# Altium schematic sheet Power Monitor.SchDoc: Power Monitor
size OrCAD A; DocumentNumber: LM-003; Revision: 3.0; SheetNumber: 7; SheetTotal: 11
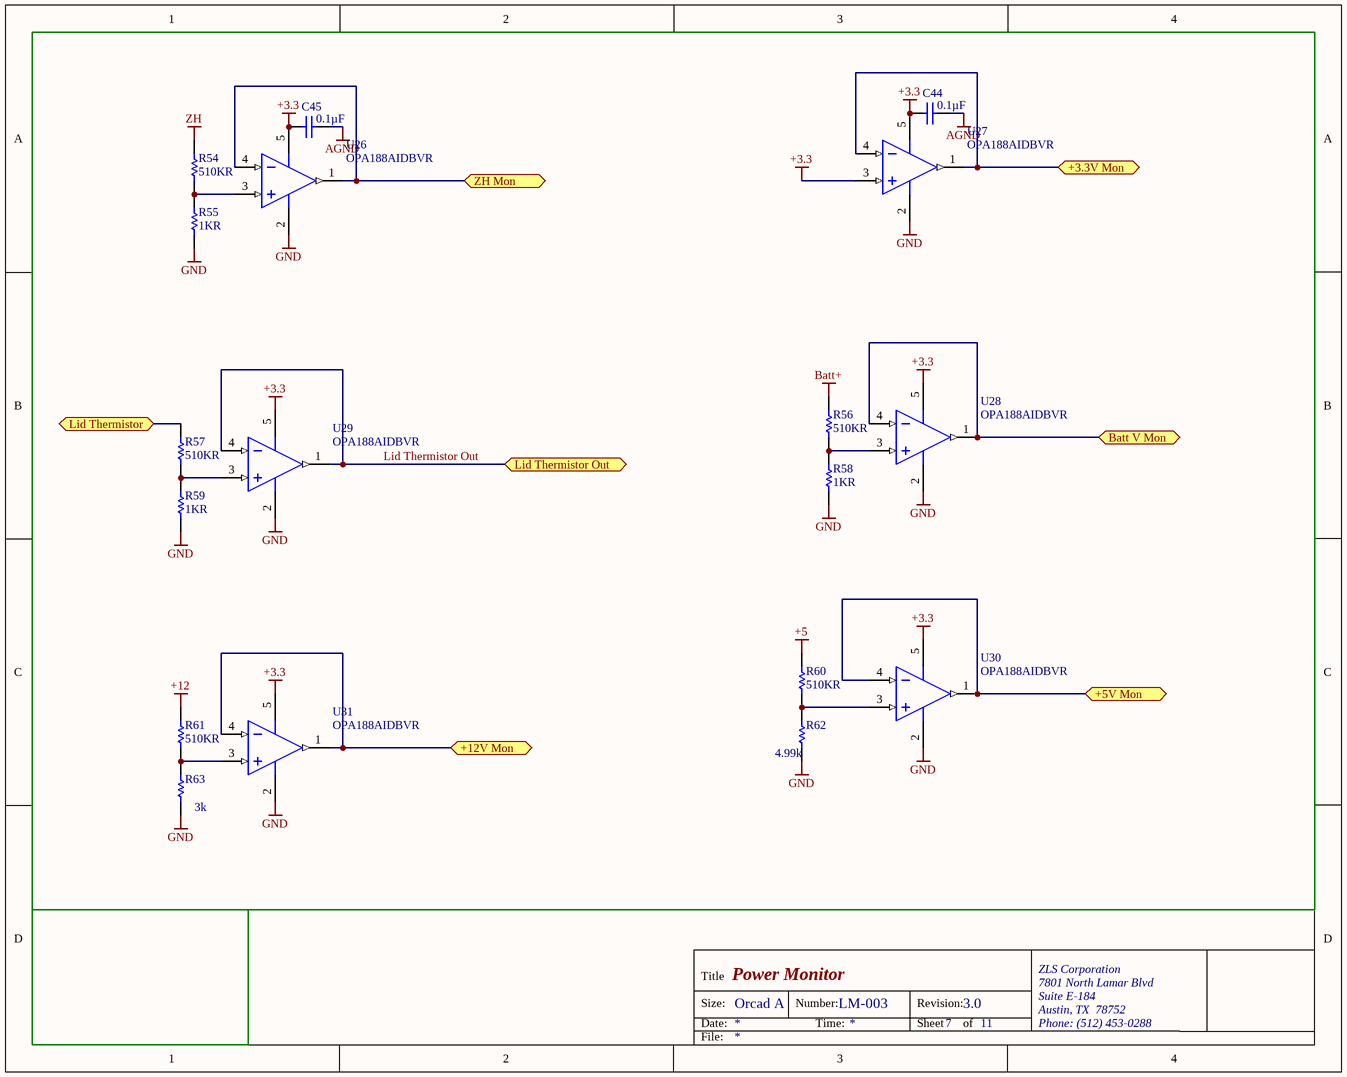
[diagram p0: Power Monitor.SchDoc]

## Parts
C44  Capacitance: 0.1µF  [CAPC0805(2012)145_N]  (hidden comment: CAP CER 0.1UF 25V X7R 0805)
C45  Capacitance: 0.1µF  [CAPC0805(2012)145_N]  (hidden comment: CAP CER 0.1UF 25V X7R 0805)
R54  Resistance: 510KR  [RESC0402(1005)_M]  (hidden comment: RES SMD 510K OHM 1% 1/16W 0402)
R55  Resistance: 1KR  [RESC0402(1005)_M]  (hidden comment: RES SMD 1K OHM 1% 1/16W 0402)
R56  Resistance: 510KR  [RESC0402(1005)_M]  (hidden comment: RES SMD 510K OHM 1% 1/16W 0402)
R57  Resistance: 510KR  [RESC0402(1005)_M]  (hidden comment: RES SMD 510K OHM 1% 1/16W 0402)
R58  Resistance: 1KR  [RESC0402(1005)_M]  (hidden comment: RES SMD 1K OHM 1% 1/16W 0402)
R59  Resistance: 1KR  [RESC0402(1005)_M]  (hidden comment: RES SMD 1K OHM 1% 1/16W 0402)
R60  Resistance: 510KR  [RESC0402(1005)_M]  (hidden comment: RES SMD 510K OHM 1% 1/16W 0402)
R61  Resistance: 510KR  [RESC0402(1005)_M]  (hidden comment: RES SMD 510K OHM 1% 1/16W 0402)
R62  Resistance (Ohms): 4.99k  [RESC0805(2012)_L]  (hidden comment: RES SMD 4.99K OHM 1% 1/8W 0805)
R63  Resistance (Ohms): 3k  [RESC0805(2012)_L]  (hidden comment: RES SMD 3K OHM 1% 1/2W 0805)
U26  OPA188AIDBVR  [DBV0005A_M]
U27  OPA188AIDBVR  [DBV0005A_M]
U28  OPA188AIDBVR  [DBV0005A_M]
U29  OPA188AIDBVR  [DBV0005A_M]
U30  OPA188AIDBVR  [DBV0005A_M]
U31  OPA188AIDBVR  [DBV0005A_M]

## Ports
+3.3V Mon, +5V Mon, +12V Mon, Batt V Mon, Lid Thermistor, Lid Thermistor Out, ZH Mon

## Nets
+3.3: C44.1 C45.1 U26.5(V+) U27.3(IN+) U27.5(V+) U28.5(V+) U29.5(V+) U30.5(V+) U31.5(V+)
+5: R60.2
+12: R61.2
AGND: C44.2 C45.2
Batt+: R56.2
GND: R55.1 R58.1 R59.1 R62.1 R63.1 U26.2(V-) U27.2(V-) U28.2(V-) U29.2(V-) U30.2(V-) U31.2(V-)
ZH: R54.2
+3.3V Mon: U27.1(OUT) U27.4(IN-) ; port +3.3V Mon
+5V Mon: U30.1(OUT) U30.4(IN-) ; port +5V Mon
+12V Mon: U31.1(OUT) U31.4(IN-) ; port +12V Mon
Batt V Mon: U28.1(OUT) U28.4(IN-) ; port Batt V Mon
Lid Thermistor: R57.2 ; port Lid Thermistor
Lid Thermistor Out: U29.1(OUT) U29.4(IN-) ; port Lid Thermistor Out
ZH Mon: U26.1(OUT) U26.4(IN-) ; port ZH Mon
NetR54_1: R54.1 R55.2 U26.3(IN+)
NetR56_1: R56.1 R58.2 U28.3(IN+)
NetR57_1: R57.1 R59.2 U29.3(IN+)
NetR60_1: R60.1 R62.2 U30.3(IN+)
NetR61_1: R61.1 R63.2 U31.3(IN+)

## Notes on the sheet
- Title
- Size:
- Date:
- Orcad A
- Number:
- Time:
- Revision:
- Sheet
- of
- ZLS Corporation
- 7801 North Lamar Blvd
- Suite E-184
- Austin, TX  78752
- Phone: (512) 453-0288
- File:

## Library data of the parts
C44 C45 = CMP-1036-04795-1: Manufacturer: Murata Electronics North America; Manufacturer Part Number: GRM21BR71E104KA01L; Tolerance: ±10%; Supplier 1: Digi-Key; Supplier Part Number 1: 490-1673-6-ND; RoHS: RoHS Compliant; Category: Capacitors; Stock 1: 891652; Pricing 1: 1=0.2, 10=0.145, 100=0.0683, 500=0.04788, 1000=0.03964 (USD); Packaging: Digi-Reel®; Part Status: Active; Voltage - Rated: 25V; Temperature Coefficient: X7R; Operating Temperature: -55°C ~ 125°C; Features: -; Ratings: -; Applications: General Purpose; Mounting Type: Surface Mount, MLCC; Package / Case: 0805 (2012 Metric); Size / Dimension: 0.079" L x 0.049" W (2.00mm x 1.25mm); Height - Seated (Max): -; Thickness (Max): 0.053" (1.35mm); Lead Spacing: -; Lead Style: -; ComponentLink1URL: http://www.murata.com/~/media/webrenewal/support/library/catalog/products/capacitor/mlcc/c02e.ashx; ComponentLink1Description: http://www.murata.com/~/media/webrenewal/support/library/catalog/products/capacitor/mlcc/c02e.ashx
R54 R56 R57 R60 R61 = CMP-1011-00651-1: Manufacturer: Vishay; Manufacturer Part Number: CRCW0402510KFKED; Power Rating: 63mW; Voltage Rating: 50V; Temperature Coefficient: 100ppm/°C; Supplier 1: Mouser; Supplier Part Number 1: 71-CRCW0402510KFKED; Description: RES SMD 510K OHM 1% 1/16W 0402; Stock 1: 26232; Pricing 1: 1=0.1, 10=0.045, 50=0.045, 100=0.026, 1000=0.018, 10000=0.006 (USD); Case/Package: 0402; Number of Pins: 2; Weight: 2.3E-05oz; Case Code (Imperial): 0402; Case Code (Metric): 1005; Contact Plating: Tin; Min Operating Temperature: -55°C; Max Operating Temperature: 155°C; Tolerance: 1%; Packaging: Tape and Reel; Composition: Thick Film; Termination: SMD/SMT; Military Standard: Not; Package Quantity: 10; Voltage Rating (DC): 50V; Number of Terminations: 2; Max Power Dissipation: 63mW; Length: 1mm; Height: 0.35mm; Width: 0.5mm; Depth: 0.5mm; Radiation Hardening: No; REACH SVHC: Unknown; Lead Free: Lead Free; ComponentLink1URL: https://datasheet.ciiva.com/11812/0900766b80d98824-11812324.pdf; ComponentLink1Description: https://datasheet.ciiva.com/11812/0900766b80d98824-11812324.pdf; ComponentLink2URL: https://datasheet.ciiva.com/7670/1697337-7670777.pdf; ComponentLink2Description: https://datasheet.ciiva.com/7670/1697337-7670777.pdf; ComponentLink3URL: https://datasheet.ciiva.com/7670/1697337-7670778.pdf; ComponentLink3Description: https://datasheet.ciiva.com/7670/1697337-7670778.pdf; ComponentLink4URL: https://datasheet.ciiva.com/5545/dcrcwe3-109170-5545547.pdf; ComponentLink4Description: https://datasheet.ciiva.com/5545/dcrcwe3-109170-5545547.pdf; ComponentLink5URL: https://datasheet.ciiva.com/16436/dcrcwe3-16436123.pdf; ComponentLink5Description: https://datasheet.ciiva.com/16436/dcrcwe3-16436123.pdf; ComponentLink6URL: https://datasheet.ciiva.com/16775/70201119-16775995.pdf; ComponentLink6Description: https://datasheet.ciiva.com/16775/70201119-16775995.pdf; ComponentLink7URL: https://datasheet.ciiva.com/22871/70201119-22871755.pdf; ComponentLink7Description: https://datasheet.ciiva.com/22871/70201119-22871755.pdf; ComponentLink8URL: https://datasheet.ciiva.com/2463/dcrcwe3-2463820.pdf; ComponentLink8Description: https://datasheet.ciiva.com/2463/dcrcwe3-2463820.pdf; ComponentLink9URL: https://datasheet.ciiva.com/8931/dcrcwe3-8931644.pdf; ComponentLink9Description: https://datasheet.ciiva.com/8931/dcrcwe3-8931644.pdf; ComponentLink10URL: https://datasheet.ciiva.com/16881/dcrcwe3-16881740.pdf; ComponentLink10Description: https://datasheet.ciiva.com/16881/dcrcwe3-16881740.pdf; ComponentLink11URL: https://datasheet.ciiva.com/2463/dcrcwe3-2463821.pdf; ComponentLink11Description: https://datasheet.ciiva.com/2463/dcrcwe3-2463821.pdf; ComponentLink12URL: https://datasheet.ciiva.com/2463/dcrcwe3-2463822.pdf; ComponentLink12Description: https://datasheet.ciiva.com/2463/dcrcwe3-2463822.pdf; ComponentLink13URL: https://datasheet.ciiva.com/7743/dcrcwe3-7743679.pdf; ComponentLink13Description: https://datasheet.ciiva.com/7743/dcrcwe3-7743679.pdf; ComponentLink14URL: https://datasheet.ciiva.com/22706/1697337-22706223.pdf; ComponentLink14Description: https://datasheet.ciiva.com/22706/1697337-22706223.pdf
R55 R58 R59 = CMP-1011-00651-1: Manufacturer: Yageo; Manufacturer Part Number: RC0402FR-071KL; Power Rating: 62.5mW; Voltage Rating: 50V; Temperature Coefficient: 100ppm/°C; Supplier 1: Mouser; Supplier Part Number 1: 603-RC0402FR-071KL; Description: RES SMD 1K OHM 1% 1/16W 0402; Stock 1: 1861683; Pricing 1: 1=0.1, 10=0.009, 50=0.009, 100=0.003, 1000=0.002, 10000=0.002 (USD); Case/Package: 0402; Number of Pins: 2; Case Code (Imperial): 0402; Case Code (Metric): 1005; Min Operating Temperature: -55°C; Max Operating Temperature: 155°C; Tolerance: 1%; Packaging: Tape and Reel; Termination: SMD/SMT; Military Standard: Not; Voltage Rating (DC): 50V; Composition: Thick Film; Length: 1mm; Height: 0.32mm; Width: 0.5mm; Depth: 0.5mm; REACH SVHC: Unknown; Lead Free: Lead Free; ComponentLink1URL: https://datasheet.ciiva.com/11819/0900766b80c66297-11819477.pdf; ComponentLink1Description: https://datasheet.ciiva.com/11819/0900766b80c66297-11819477.pdf; ComponentLink2URL: https://datasheet.ciiva.com/12666/pyu-rc0402-51-rohs-l-6-r-12666741.pdf; ComponentLink2Description: https://datasheet.ciiva.com/12666/pyu-rc0402-51-rohs-l-6-r-12666741.pdf; ComponentLink3URL: https://datasheet.ciiva.com/17063/pyu-rc0402-51-rohs-l-6-r-17063193.pdf; ComponentLink3Description: https://datasheet.ciiva.com/17063/pyu-rc0402-51-rohs-l-6-r-17063193.pdf; ComponentLink4URL: https://datasheet.ciiva.com/22747/1018594-22747513.pdf; ComponentLink4Description: https://datasheet.ciiva.com/22747/1018594-22747513.pdf; ComponentLink5URL: https://datasheet.ciiva.com/7849/1018594-7849869.pdf; ComponentLink5Description: https://datasheet.ciiva.com/7849/1018594-7849869.pdf; ComponentLink6URL: https://datasheet.ciiva.com/7983/1018594-7983502.pdf; ComponentLink6Description: https://datasheet.ciiva.com/7983/1018594-7983502.pdf; ComponentLink7URL: https://datasheet.ciiva.com/7849/1018594-7849871.pdf; ComponentLink7Description: https://datasheet.ciiva.com/7849/1018594-7849871.pdf
R62 = CMP-1013-00393-1: Manufacturer: Vishay Dale; Manufacturer Part Number: CRCW08054K99FKTA; Power (Watts): 0.125W, 1/8W; Temperature Coefficient: ±100ppm/°C; Supplier 1: Digi-Key; Supplier Part Number 1: 541-3030-6-ND; RoHS: RoHS non-compliant; Category: Resistors; Stock 1: 14290; Pricing 1: 1=0.14, 10=0.129, 100=0.0496, 1000=0.02183, 2500=0.01885 (USD); Packaging: Digi-Reel®; Part Status: Active; Tolerance: ±1%; Composition: Thick Film; Features: Automotive AEC-Q200; Operating Temperature: -55°C ~ 155°C; Package / Case: 0805 (2012 Metric); Supplier Device Package: 0805; Size / Dimension: 0.079" L x 0.049" W (2.00mm x 1.25mm); Height - Seated (Max): 0.020" (0.50mm); Failure Rate: -; ComponentLink1URL: http://www.vishay.com/docs/20008/dcrcw.pdf; ComponentLink1Description: http://www.vishay.com/docs/20008/dcrcw.pdf
R63 = CMP-1013-00393-1: Manufacturer: Vishay Dale; Manufacturer Part Number: CRCW08053K00FKEAHP; Power (Watts): 0.5W, 1/2W; Temperature Coefficient: ±100ppm/°C; Supplier 1: Digi-Key; Supplier Part Number 1: 541-3.00KTDKR-ND; RoHS: RoHS Compliant; Category: Resistors; Stock 1: 4756; Pricing 1: 1=0.28, 10=0.233, 100=0.0911, 1000=0.03812, 2500=0.03494 (USD); Packaging: Digi-Reel®; Part Status: Active; Tolerance: ±1%; Composition: Thick Film; Features: Automotive AEC-Q200, Pulse Withstanding; Operating Temperature: -55°C ~ 155°C; Package / Case: 0805 (2012 Metric); Supplier Device Package: 0805; Size / Dimension: 0.079" L x 0.049" W (2.00mm x 1.25mm); Height - Seated (Max): 0.020" (0.50mm); Failure Rate: -; ComponentLink1URL: http://www.vishay.com/docs/20043/crcwhpe3.pdf; ComponentLink1Description: http://www.vishay.com/docs/20043/crcwhpe3.pdf
U26-U31 = CMP-0809-00005-2: Precision, Low Noise, Rail-to-Rail Output, Zero-Drift Operational Amplifier, 4 to 36 V, -40 to 125 degC, 5-pin SOT23 (DBV5), Green (RoHS & no Sb/Br); Manufacturer: Texas Instruments; Total Supply Voltage(Min)(+5V is 5, +/-5V is 10): 4; Offset Drift(Typ)(uV/C): 0.03; Rating: Catalog; SubFamily: Zero Drift Precision Amplifier; GBW(Typ)(MHz): 2; Slew Rate(Typ)(V/us): 0.8; Number of Channels: 1; CMRR(Min)(dB): 120; Iq per channel(Max)(mA): 0.51; Total Supply Voltage(Max)(+5V is 5, +/-5V is 10): 36; PartNumber: OPA188AIDBVR; ComponentLink2Description: Datasheet; ComponentLink2URL: http://www.ti.com/lit/ds/symlink/opa188.pdf; ComponentLink1Description: Manufacturer URL; Mounting Technology: Surface Mount; Eco-Plan: Green (RoHS & no Sb/Br); ComponentLink1URL: http://www.ti.com/; PackageVersion: 4073253-4/K, 03/2006; DatasheetVersion: SBOS642A; ComponentLink3Description: Package Specification; PackageReference: DBV0005A; ComponentLink3URL: http://www.ti.com/litv/pdf/mpds018i; PackageDescription: 5-Pin Plastic Small Outline, Body 1.6 x 2.9 mm, Pitch 0.95 mm; Code_JEDEC: MO-178